# EAGLE design turbo-ds (EAGLE 7.3.0)
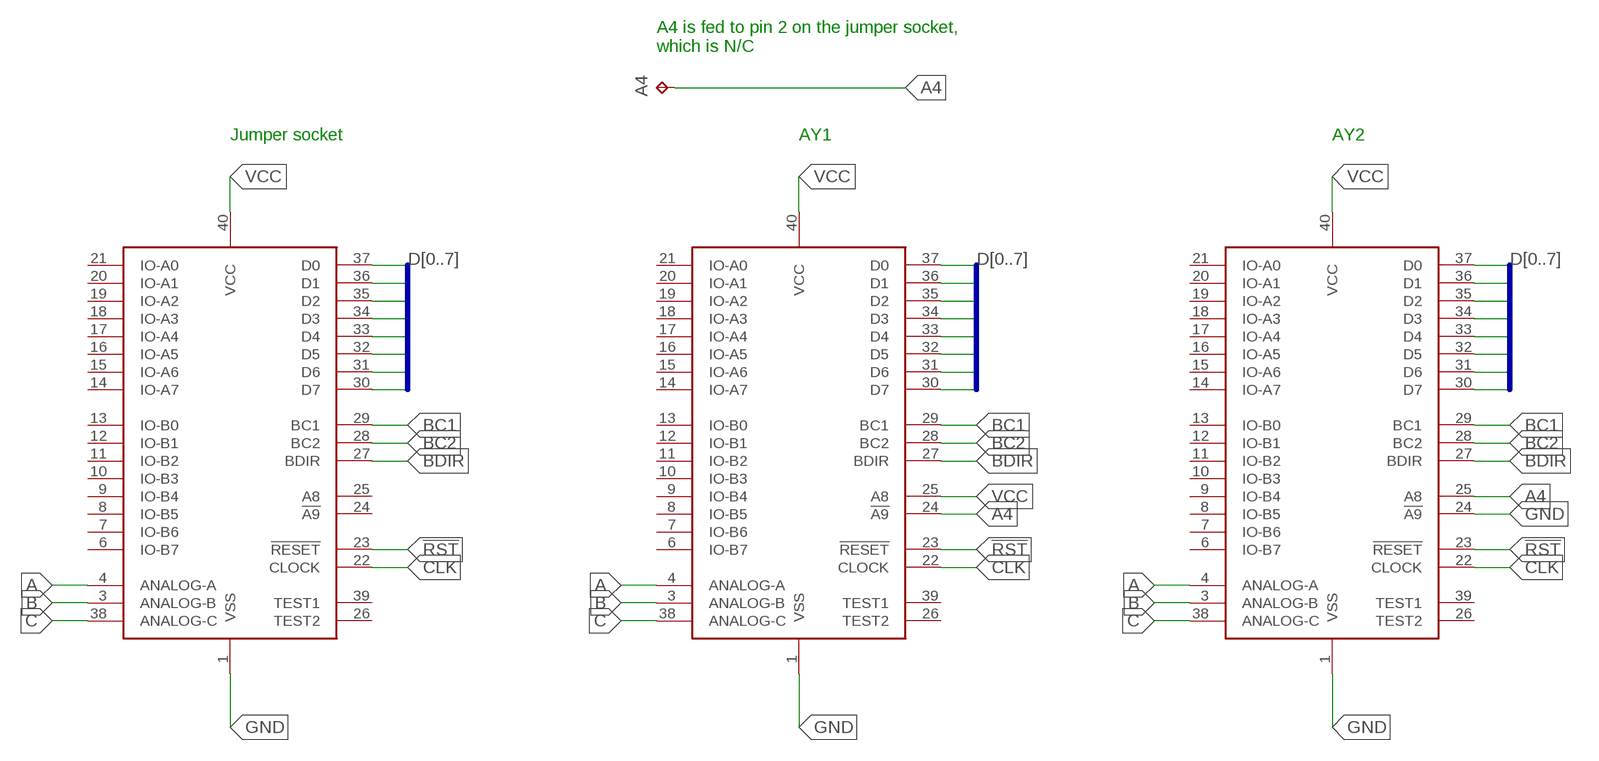
[diagram p0: schematic, sheet 1]

## Parts
A4  TPB1,27  [B1,27]
AY1  AY-3-8910  [DIL40]
AY2  AY-3-8910  [DIL40]
INPUT  AY-3-8910  [DIL40]

## Nets
!RST: AY1.23(!RESET) AY2.23(!RESET) INPUT.23(!RESET)
A: AY1.4(ANALOG-A) AY2.4(ANALOG-A) INPUT.4(ANALOG-A)
A4: A4.TP AY1.24(!A9) AY2.25(A8)
B: AY1.3(ANALOG-B) AY2.3(ANALOG-B) INPUT.3(ANALOG-B)
BC1: AY1.29(BC1) AY2.29(BC1) INPUT.29(BC1)
BC2: AY1.28(BC2) AY2.28(BC2) INPUT.28(BC2)
BDIR: AY1.27(BDIR) AY2.27(BDIR) INPUT.27(BDIR)
C: AY1.38(ANALOG-C) AY2.38(ANALOG-C) INPUT.38(ANALOG-C)
CLK: AY1.22(CLOCK) AY2.22(CLOCK) INPUT.22(CLOCK)
D0: AY1.37(D0) AY2.37(D0) INPUT.37(D0)
D1: AY1.36(D1) AY2.36(D1) INPUT.36(D1)
D2: AY1.35(D2) AY2.35(D2) INPUT.35(D2)
D3: AY1.34(D3) AY2.34(D3) INPUT.34(D3)
D4: AY1.33(D4) AY2.33(D4) INPUT.33(D4)
D5: AY1.32(D5) AY2.32(D5) INPUT.32(D5)
D6: AY1.31(D6) AY2.31(D6) INPUT.31(D6)
D7: AY1.30(D7) AY2.30(D7) INPUT.30(D7)
GND: AY1.1(VSS) AY2.1(VSS) AY2.24(!A9) INPUT.1(VSS)
VCC: AY1.25(A8) AY1.40(VCC) AY2.40(VCC) INPUT.40(VCC)
Unconnected: AY1.6(IO-B7) AY1.7(IO-B6) AY1.8(IO-B5) AY1.9(IO-B4) AY1.10(IO-B3) AY1.11(IO-B2) AY1.12(IO-B1) AY1.13(IO-B0) AY1.14(IO-A7) AY1.15(IO-A6) AY1.16(IO-A5) AY1.17(IO-A4) AY1.18(IO-A3) AY1.19(IO-A2) AY1.20(IO-A1) AY1.21(IO-A0) AY1.26(TEST2) AY1.39(TEST1) AY2.6(IO-B7) AY2.7(IO-B6) AY2.8(IO-B5) AY2.9(IO-B4) AY2.10(IO-B3) AY2.11(IO-B2) AY2.12(IO-B1) AY2.13(IO-B0) AY2.14(IO-A7) AY2.15(IO-A6) AY2.16(IO-A5) AY2.17(IO-A4) AY2.18(IO-A3) AY2.19(IO-A2) AY2.20(IO-A1) AY2.21(IO-A0) AY2.26(TEST2) AY2.39(TEST1) INPUT.6(IO-B7) INPUT.7(IO-B6) INPUT.8(IO-B5) INPUT.9(IO-B4) INPUT.10(IO-B3) INPUT.11(IO-B2) INPUT.12(IO-B1) INPUT.13(IO-B0) INPUT.14(IO-A7) INPUT.15(IO-A6) INPUT.16(IO-A5) INPUT.17(IO-A4) INPUT.18(IO-A3) INPUT.19(IO-A2) INPUT.20(IO-A1) INPUT.21(IO-A0) INPUT.24(!A9) INPUT.25(A8) INPUT.26(TEST2) INPUT.39(TEST1)

## Buses
D[0..7]

## Notes on the sheet
- A4 is fed to pin 2 on the jumper socket,
  which is N/C
- Jumper socket | AY1 | AY2

## Library data of the parts
A4 = testpad:TP: Test pad
AY1 AY2 INPUT = ay-3891x:AY-3-8910

## Board
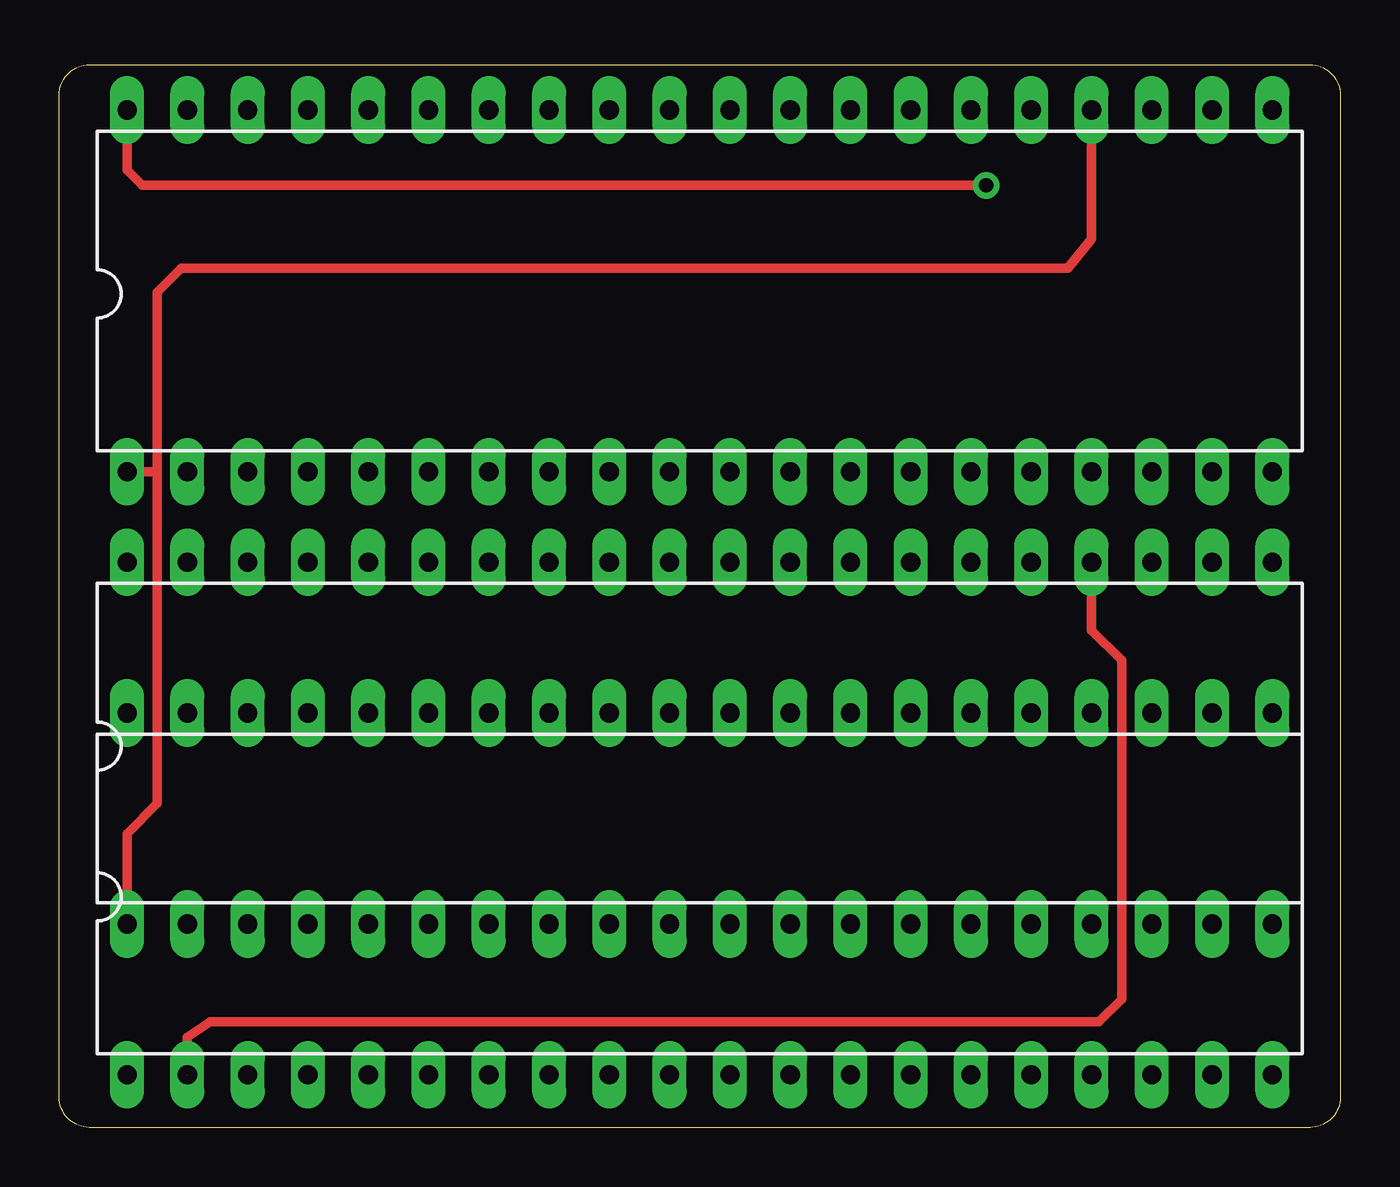
[diagram p1: board, top side]
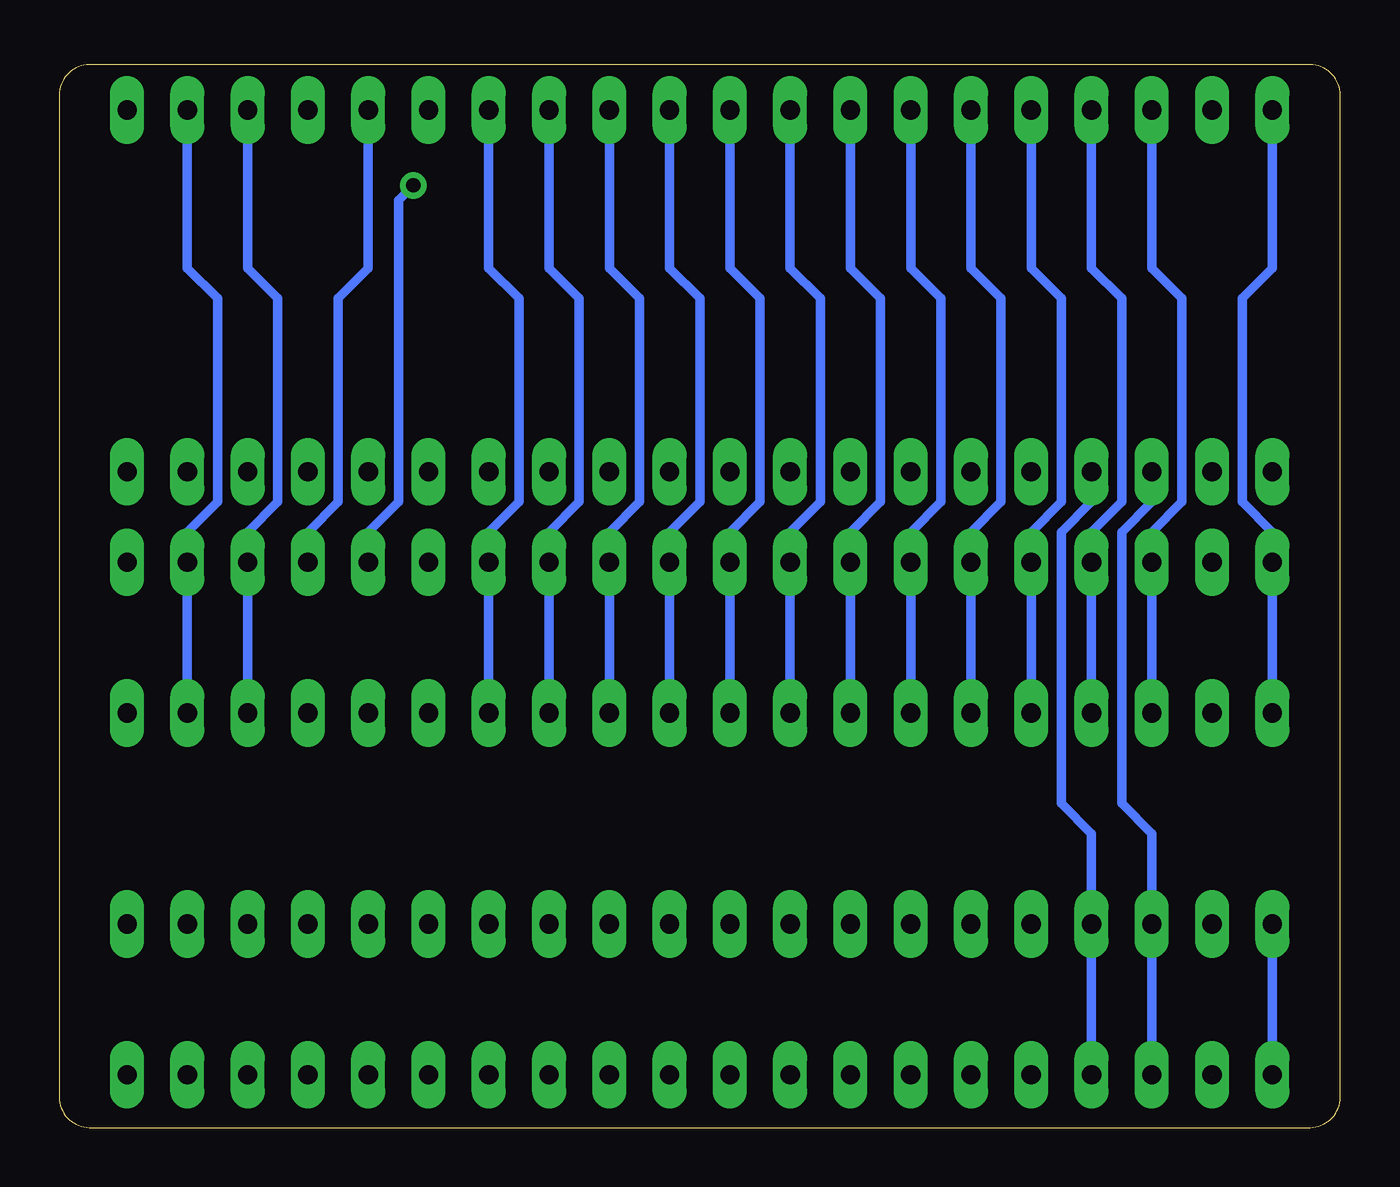
[diagram p2: board, bottom side, seen from below]

Size 53.97 x 44.77 mm. Coordinates in mm from the lower left corner, seen from the top.
Outline: 52.71,0 1.27,0 arc-90 0,1.27 0,43.5 arc-90 1.27,44.77 52.71,44.77 arc-90 53.97,43.5 53.97,1.27 arc-90 52.71,0
Copper layers (1*16): Top 0.035mm / dielectric 1.5mm / Bottom 0.035mm
Design rules "SparkFun": minimum track width 8mil, minimum drill 20mil, track to track 8mil, track to pad 8mil, pad to pad 8mil, via to via 8mil, smd to smd 8mil, copper to edge 10mil, drill to drill 8mil, minimum pad ring 12mil, minimum via ring 10mil, stop-mask expansion 4mil, vias tented up to drill 25mil, thermal gap 10mil

### Footprints (pad centres in the part's own frame; a part is rotated, then mirrored left to right if it is on the bottom)
B1,27 = smd 1.27 x 1.27: TP 0,0
DIL40 = drill 0.813 long: 1 -24.13,-7.62; 2 -21.59,-7.62; 3 -19.05,-7.62; 4 -16.51,-7.62; 5 -13.97,-7.62; 6 -11.43,-7.62; 7 -8.89,-7.62; 8 -6.35,-7.62; 9 -3.81,-7.62; 10 -1.27,-7.62; 11 1.27,-7.62; 12 3.81,-7.62; 13 6.35,-7.62; 14 8.89,-7.62; 15 11.43,-7.62; 16 13.97,-7.62; 17 16.51,-7.62; 18 19.05,-7.62; 19 21.59,-7.62; 20 24.13,-7.62; 21 24.13,7.62; 22 21.59,7.62; 23 19.05,7.62; 24 16.51,7.62; 25 13.97,7.62; 26 11.43,7.62; 27 8.89,7.62; 28 6.35,7.62; 29 3.81,7.62; 30 1.27,7.62; 31 -1.27,7.62; 32 -3.81,7.62; 33 -6.35,7.62; 34 -8.89,7.62; 35 -11.43,7.62; 36 -13.97,7.62; 37 -16.51,7.62; 38 -19.05,7.62; 39 -21.59,7.62; 40 -24.13,7.62

### Placement (x,y rotation side)
A4  5.4,2.22 0 bottom
AY1  26.99,16.19 0 top
AY2  26.99,35.24 0 top
INPUT  26.99,9.84 0 top

### Tracks (layer width: path | path; a pad name or v marks a point on that pad's centre or on a via)
!RST
  Bottom 0.406: INPUT.23 AY1.23 46.04,25.08 44.77,26.35 44.77,34.92 46.04,36.2 AY2.23
A
  Bottom 0.406: INPUT.4 AY1.4 10.48,12.38 11.75,13.65 11.75,25.08 10.48,26.35 AY2.4
A4  (1 unrouted)
  Top 0.406: A4.TP 5.4,3.81 6.35,4.45 43.81,4.45 44.77,5.4 44.77,19.68 43.5,20.96 AY1.24
  Bottom 0.406: AY2.25 40.96,36.2 42.23,34.92 42.23,26.35 43.5,25.08 AY1.24
B
  Bottom 0.406: INPUT.3 AY1.3 7.94,12.38 9.21,13.65 9.21,25.08 7.94,26.35 AY2.3
BC1
  Bottom 0.406: INPUT.29 AY1.29 30.8,25.08 29.53,26.35 29.53,34.92 30.8,36.2 AY2.29
BC2
  Bottom 0.406: INPUT.28 AY1.28 33.34,25.08 32.07,26.35 32.07,34.92 33.34,36.2 AY2.28
BDIR
  Bottom 0.406: INPUT.27 AY1.27 35.88,25.08 34.61,26.35 34.61,34.92 35.88,36.2 AY2.27
C
  Bottom 0.406: INPUT.38 AY1.38 7.94,25.08 6.67,26.35 6.67,34.92 7.94,36.2 AY2.38
CLK
  Bottom 0.406: INPUT.22 AY1.22 48.58,25.08 47.31,26.35 47.31,34.92 48.58,36.2 AY2.22
D0
  Bottom 0.406: INPUT.37 AY1.37 10.48,25.08 9.21,26.35 9.21,34.92 10.48,36.2 AY2.37
D1
  Bottom 0.406: INPUT.36 AY1.36 13.02,25.08 11.75,26.35 11.75,34.92 13.02,36.2 AY2.36
D2
  Bottom 0.406: INPUT.35 AY1.35 15.56,25.08 14.29,26.35 14.29,34.92 15.56,36.2 AY2.35
D3
  Bottom 0.406: INPUT.34 AY1.34 18.1,25.08 16.83,26.35 16.83,34.92 18.1,36.2 AY2.34
D4
  Bottom 0.406: INPUT.33 AY1.33 20.64,25.08 19.37,26.35 19.37,34.92 20.64,36.2 AY2.33
D5
  Bottom 0.406: INPUT.32 AY1.32 23.18,25.08 21.91,26.35 21.91,34.92 23.18,36.2 AY2.32
D6
  Bottom 0.406: INPUT.31 AY1.31 25.72,25.08 24.45,26.35 24.45,34.92 25.72,36.2 AY2.31
D7
  Bottom 0.406: INPUT.30 AY1.30 28.26,25.08 26.99,26.35 26.99,34.92 28.26,36.2 AY2.30
GND
  Top 0.406: AY2.24 43.5,37.42 42.5,36.2 5.13,36.2 4.13,35.2 4.13,27.62 | 4.13,27.62 4.13,13.65 2.86,12.38 AY1.1 | AY2.1 4.13,27.62
  Bottom 0.406: INPUT.1 AY1.1
VCC  (via drill 0.6)
  Top 0.406: v39.05,39.69 3.49,39.69 2.86,40.32 AY2.40
  Bottom 0.406: AY2.40 2.86,36.2 4.13,34.92 4.13,26.35 2.86,25.08 AY1.40 INPUT.40 | AY1.25 40.96,25.08 39.69,26.35 39.69,39.05 v39.05,39.69